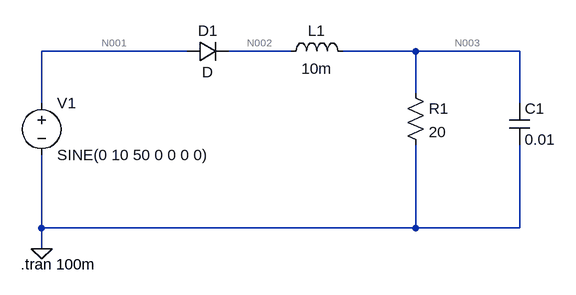
[diagram p0: schematic rectification-v3.asc]
rectification-v3.asc, the LTspice schematic file:
Version 4.1
SHEET 1 880 680
WIRE -16 64 -240 64
WIRE 144 64 48 64
WIRE 336 64 224 64
WIRE 496 64 336 64
WIRE 336 128 336 64
WIRE -240 144 -240 64
WIRE 496 144 496 64
WIRE -240 336 -240 224
WIRE 336 336 336 208
WIRE 336 336 -240 336
WIRE 496 336 496 208
WIRE 496 336 336 336
WIRE -240 368 -240 336
FLAG -240 368 0
SYMBOL res 320 112 R0
SYMATTR InstName R1
SYMATTR Value 20
SYMBOL diode -16 80 R270
WINDOW 0 32 32 VTop 2
WINDOW 3 0 32 VBottom 2
SYMATTR InstName D1
SYMBOL ind 128 80 R270
WINDOW 0 32 56 VTop 2
WINDOW 3 5 56 VBottom 2
SYMATTR InstName L1
SYMATTR Value 10m
SYMBOL cap 480 144 R0
SYMATTR InstName C1
SYMATTR Value 0.01
SYMBOL voltage -240 128 R0
WINDOW 123 0 0 Left 0
WINDOW 39 0 0 Left 0
SYMATTR InstName V1
SYMATTR Value SINE(0 10 50 0 0 0 0)
TEXT -272 392 Left 2 !.tran 100m

The netlist it stands for:
* rectification-v3.asc
R1 N003 0 20
D1 N001 N002 D
L1 N002 N003 10m
C1 N003 0 0.01
V1 N001 0 SINE(0 10 50 0 0 0 0)
.model D D
.lib standard.dio
.tran 100m
.backanno
.end

* Results of the author's LTspice run, read from the files saved beside the schematic
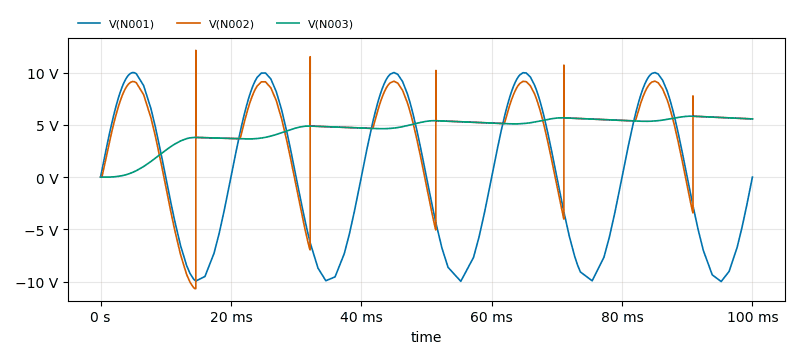
[diagram p1: Transient Analysis of rectification-v3.asc, plotted from the saved traces]
* Transient Analysis, 1 run:
*   V(N001): min -9.979 V, max 10 V, average 36.65 mV, rms 7.03 V, last 0 V
*   V(N002): min -10.67 V, max 12.12 V, average 4.515 V, rms 5.934 V, last 5.564 V
*   V(N003): min 0 V, max 5.828 V, average 4.52 V, rms 4.745 V, last 5.564 V